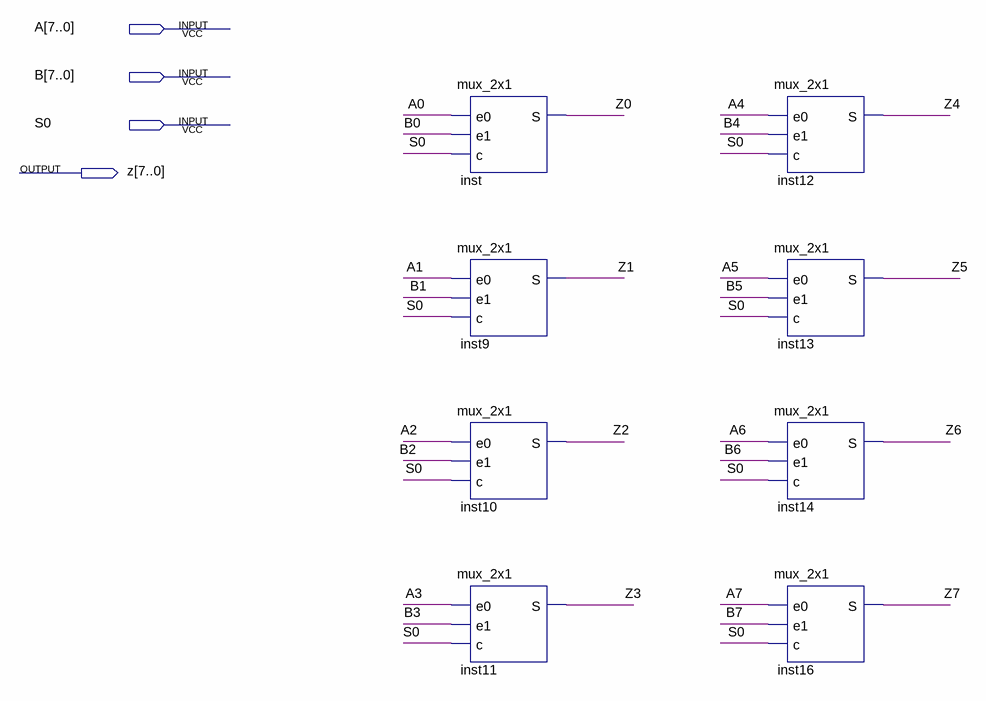
[diagram p0: schematic sheet]
// Quartus schematic mux_8bit.bdf as structural Verilog: 8 symbols, 4 pins
module mux_8bit (
  input  [7:0] A,
  input  [7:0] B,
  input  S0,
  output [7:0] z
);

  mux_2x1 inst (.e0(A[0]), .e1(B[0]), .c(S0), .S(z[0]));
  mux_2x1 inst9 (.e0(A[1]), .e1(B[1]), .c(S0), .S(z[1]));
  mux_2x1 inst10 (.e0(A[2]), .e1(B[2]), .c(S0), .S(z[2]));
  mux_2x1 inst11 (.e0(A[3]), .e1(B[3]), .c(S0), .S(z[3]));
  mux_2x1 inst12 (.e0(A[4]), .e1(B[4]), .c(S0), .S(z[4]));
  mux_2x1 inst13 (.e0(A[5]), .e1(B[5]), .c(S0), .S(z[5]));
  mux_2x1 inst14 (.e0(A[6]), .e1(B[6]), .c(S0), .S(z[6]));
  mux_2x1 inst16 (.e0(A[7]), .e1(B[7]), .c(S0), .S(z[7]));
endmodule
